# EAGLE schematic main (EAGLE 8.3.1)
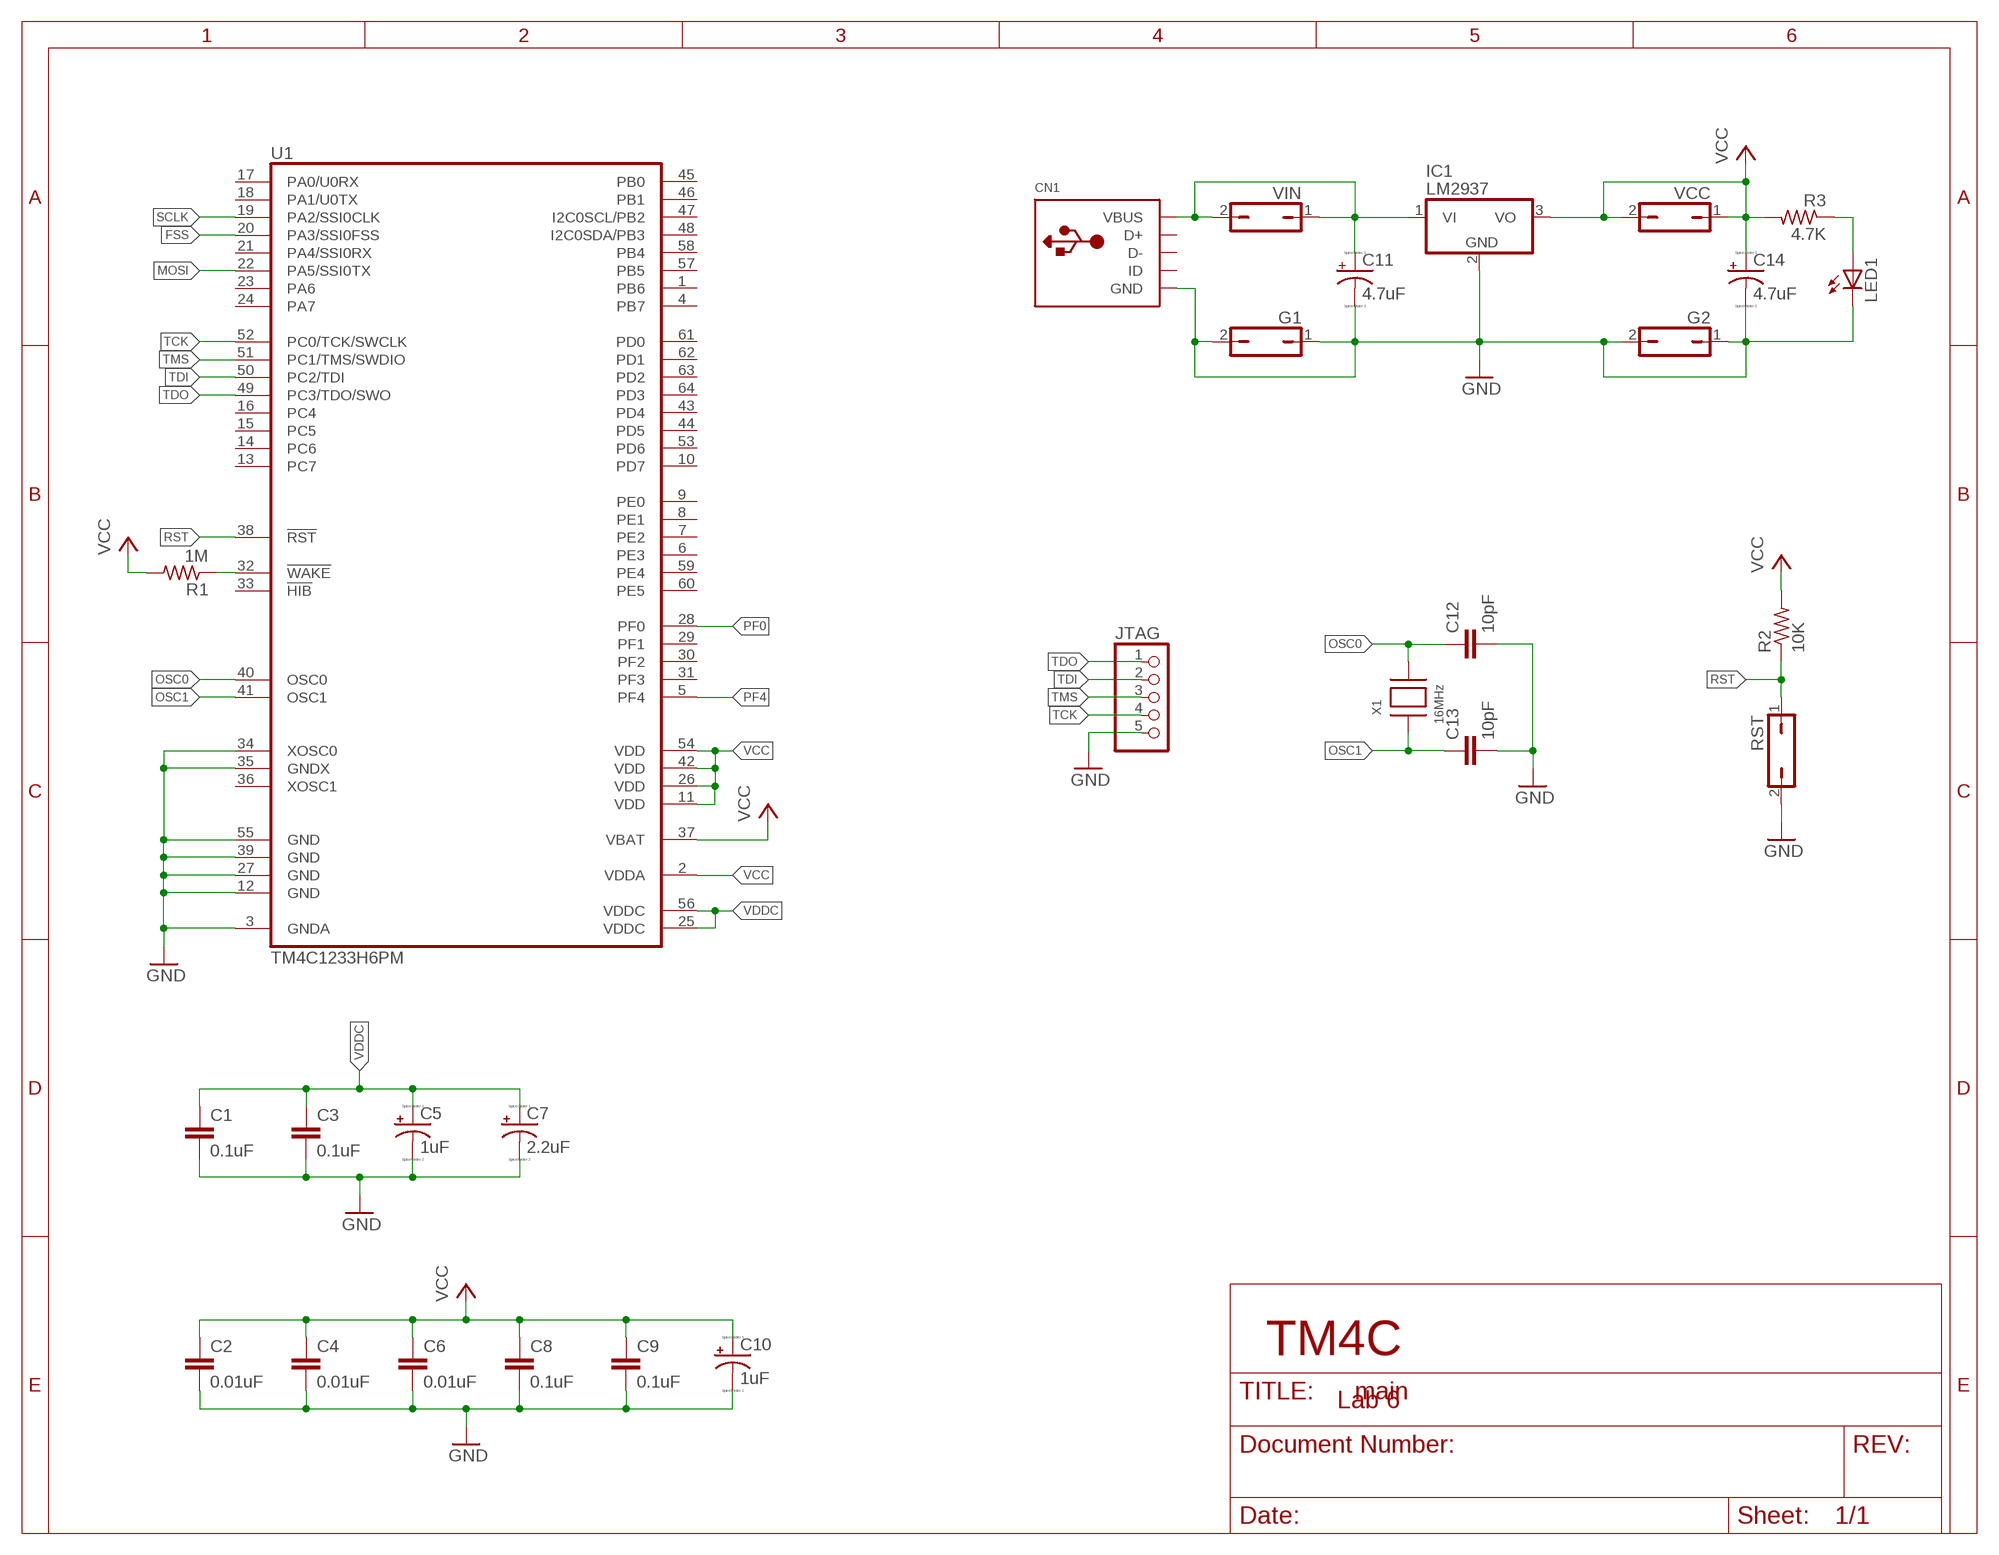
[diagram p0: schematic, sheet 1, part 1 of 2]
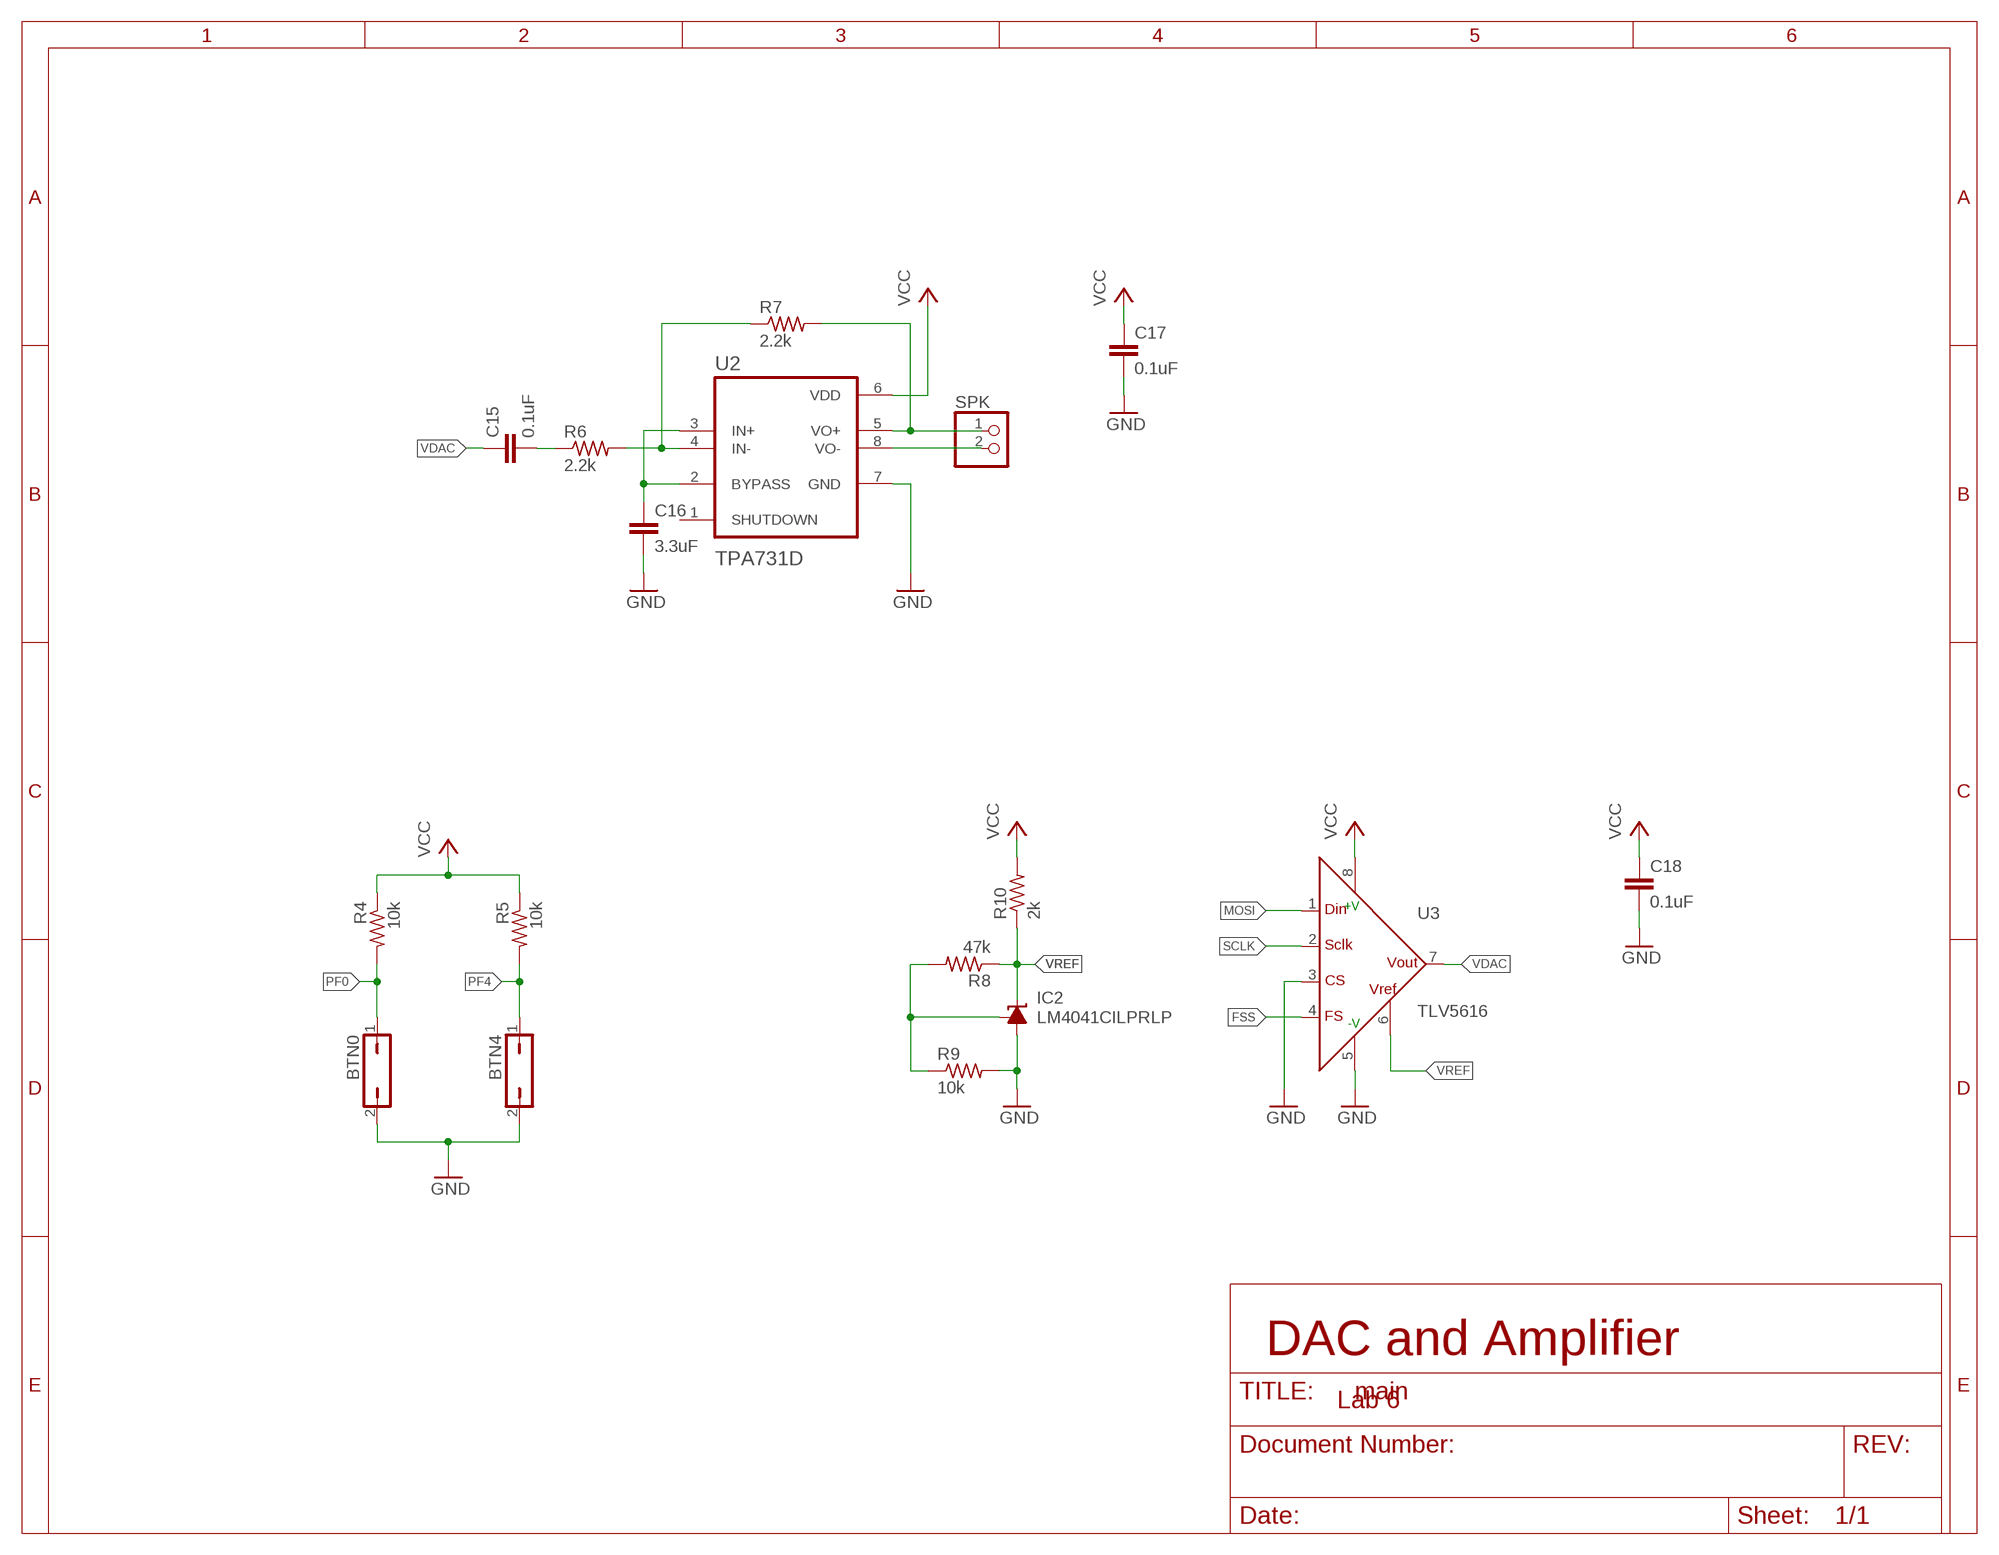
[diagram p1: schematic, sheet 1, part 2 of 2]

## Parts
BTN0  JP1Q  [JP1]
BTN4  JP1Q  [JP1]
C1  0.1uF  C-EUC0603  [C0603]
C2  0.01uF  C-EUC0603  [C0603]
C3  0.1uF  C-EUC0603  [C0603]
C4  0.01uF  C-EUC0603  [C0603]
C5  1uF  CPOL-USD  [PANASONIC_D]
C6  0.01uF  C-EUC0603  [C0603]
C7  2.2uF  CPOL-USD  [PANASONIC_D]
C8  0.1uF  C-EUC0603  [C0603]
C9  0.1uF  C-EUC0603  [C0603]
C10  1uF  CPOL-USD  [PANASONIC_D]
C11  4.7uF  CPOL-USD  [PANASONIC_D]
C12  10pF  C-EUC0603  [C0603]
C13  10pF  C-EUC0603  [C0603]
C14  4.7uF  CPOL-USD  [PANASONIC_D]
C15  0.1uF  C-EUC0603  [C0603]
C16  3.3uF  C-EU050-035X075  [C050-035X075]
C17  0.1uF  C-EUC0603  [C0603]
C18  0.1uF  C-EUC0603  [C0603]
CN1  USBMINIB  [USB-MINIB]
G1  JP1Q  [JP1]
G2  JP1Q  [JP1]
IC1  LM2937  [TO263-3]
IC2  LM4041CILPRLP  [LP_O-PBCY-W3]
JTAG  PINHD-1X5  [1X05]
LED1  LEDCHIPLED_0603  [CHIPLED_0603]
R1  1M  R-US_R0603  [R0603]
R2  10K  R-US_R0603  [R0603]
R3  4.7K  R-US_R0603  [R0603]
R4  10k  R-US_R0603  [R0603]
R5  10k  R-US_R0603  [R0603]
R6  2.2k  R-US_R0603  [R0603]
R7  2.2k  R-US_R0603  [R0603]
R8  47k  R-US_R0603  [R0603]
R9  10k  R-US_R0603  [R0603]
R10  2k  R-US_R0603  [R0603]
RST  JP1Q  [JP1]
SPK  PINHD-1X2  [1X02]
U1  TM4C1233H6PM  [LQFP64]
U2  TPA731D  [SOIC127P600X175-8N]
U3  TLV5616  [DIL08]
U$1  DIP-8  [DIP-8]  (not placed on a sheet)
VCC  JP1Q  [JP1]
VIN  JP1Q  [JP1]
X1  16MHz  XTALNX8045  [NX8045]

## Nets
5V_IN: C11.+ CN1.VBUS IC1.1(VI) VIN.1 VIN.2
AMP_DC_FILTER: C15.2 R6.1
AMP_IN+: C16.1 U2.2(BYPASS) U2.3(IN+)
AMP_IN-: R6.2 R7.1 U2.4(IN-)
FSS: U1.20(PA3/SSI0FSS) U3.4(FS)
GND: BTN0.2 BTN4.2 C1.2 C2.2 C3.2 C4.2 C5.- C6.2 C7.- C8.2 C9.2 C10.- C11.- C12.2 C13.2 C14.- C16.2 C17.2 C18.2 CN1.GND G1.1 G1.2 G2.1 G2.2 IC1.2(GND) IC2.3(A) JTAG.5 LED1.C R9.2 RST.2 U1.3(GNDA) U1.12(GND) U1.27(GND) U1.34(XOSC0) U1.35(GNDX) U1.39(GND) U1.55(GND) U2.7(GND) U3.3(CS) U3.5(AGND)
LED_RESIST: LED1.A R3.1
MOSI: U1.22(PA5/SSI0TX) U3.1(DIN)
OSC0: C12.1 U1.40(OSC0) X1.P$2
OSC1: C13.1 U1.41(OSC1) X1.P$1
PF0: BTN0.1 R4.2 U1.28(PF0)
PF4: BTN4.1 R5.2 U1.5(PF4)
RST: R2.1 RST.1 U1.38(!RST!)
SCLK: U1.19(PA2/SSI0CLK) U3.2(SCLK)
TCK: JTAG.4 U1.52(PC0/TCK/SWCLK)
TDI: JTAG.2 U1.50(PC2/TDI)
TDO: JTAG.1 U1.49(PC3/TDO/SWO)
TMS: JTAG.3 U1.51(PC1/TMS/SWDIO)
VCC: C2.1 C4.1 C6.1 C8.1 C9.1 C10.+ C14.+ C17.1 C18.1 IC1.3(VO) R1.2 R2.2 R3.2 R4.1 R5.1 R10.2 U1.2(VDDA) U1.11(VDD) U1.26(VDD) U1.37(VBAT) U1.42(VDD) U1.54(VDD) U2.6(VDD) U3.8(VDD) VCC.1 VCC.2
VDAC: C15.1 U3.7(OUT)
VDDC: C1.1 C3.1 C5.+ C7.+ U1.25(VDDC) U1.56(VDDC)
VO+: R7.2 SPK.1 U2.5(VO+)
VO-: SPK.2 U2.8(VO-)
VREF: IC2.2(C) R8.1 R10.1 U3.6(REFIN)
VREF_FEEDBACK: IC2.1(FB) R8.2 R9.1
WAKE: R1.1 U1.32(!WAKE!)
Unconnected: CN1.D+ CN1.D- CN1.ID U1.1(PB6) U1.4(PB7) U1.6(PE3) U1.7(PE2) U1.8(PE1) U1.9(PE0) U1.10(PD7) U1.13(PC7) U1.14(PC6) U1.15(PC5) U1.16(PC4) U1.17(PA0/U0RX) U1.18(PA1/U0TX) U1.21(PA4/SSI0RX) U1.23(PA6) U1.24(PA7) U1.29(PF1) U1.30(PF2) U1.31(PF3) U1.33(!HIB!) U1.36(XOSC1) U1.43(PD4) U1.44(PD5) U1.45(PB0) U1.46(PB1) U1.47(I2C0SCL/PB2) U1.48(I2C0SDA/PB3) U1.53(PD6) U1.57(PB5) U1.58(PB4) U1.59(PE4) U1.60(PE5) U1.61(PD0) U1.62(PD1) U1.63(PD2) U1.64(PD3) U2.1(SHUTDOWN) U$1.1A U$1.1B U$1.2A U$1.2B U$1.3A U$1.3B U$1.4A U$1.4B

## Notes on the sheet
- TM4C | DAC and Amplifier
- Lab 6 | Lab 6

## Library data of the parts
BTN0 BTN4 G1 G2 RST VCC VIN = jumper:JP1Q: JUMPER
C1-C4 C6 C8 C9 C12 C13 C15-C18 = rcl:C-EU: CAPACITOR, European symbol
C5 C7 C10 C11 C14 = resistor:CPOL-US: POLARIZED CAPACITOR, American symbol
CN1 = adafruit:USB: USB Connectors USBMINIB - Surface Mount Female Mini-B USB Connector 4UConnector: 06564 By microbuilder.eu Thru-hole RA Female Mini-B USB Connector 4UConnector: 18732 By ladyada.net
IC1 = linear:LM2937: LM2937-2.5, LM2937-3.3 400mA and 500mA Voltage Regulators Source: http://cache.national.com/ds/LM/LM2937-2.5.pdf
IC2 = LM4041CILPR:LM4041CILPR: PRECISION MICROPOWER SHUNT VOLTAGE REFERENCE Adjustable Output Source: http://focus.ti.com/lit/ds/slcs146e/slcs146e.pdf LM4041CILPR Let R1 be the resistor from Vref to +3.3V Let R2 be the resistor from Vref to FB Let R3 be the resistor from FB to ground Vref = 1.23*(1+R3/R2) Iref=(3.3V-Vref)/R1 - 100uA; AVAILABILITY: Unavailable; DESCRIPTION: Adjustable Precision Micropower Shunt Voltage Reference, 0.5% accuracy 3-TO-92 -40 to 85; MF: Texas Instruments; MP: LM4041CILPR; PACKAGE: TO-92 Texas Instruments; PRICE: None
JTAG = pinhead:PINHD-1X5: PIN HEADER
LED1 = adafruit:LED: LED OSRAM: - CHIPLED LG R971, LG N971, LY N971, LG Q971, LY Q971, LO R971, LY R971 LH N974, LH R974 LS Q976, LO Q976, LY Q976 LO Q996 - Hyper CHIPLED LW Q18S LB Q993, LB Q99A, LB R99A - SideLED LS A670, LO A670, LY A670, LG A670, LP A670 LB A673, LV A673, LT A673, LW A673 LH A674 LY A675 LS A676, LA A676, LO A676, LY A676, LW A676 LS A679, LY A679, LG A679 - Hyper Micro SIDELED® LS Y876, LA Y876, LO Y876, LY Y876 LT Y87S - SmartLED LW L88C, LW L88S LB L89C, LB L89S, LG L890 LS L89K, LO L89K, LY L89K LS L896, LA L896, LO L896, LY L896 - TOPLED LS T670, LO T670, LY T670, LG T670, LP T670 LSG T670, LSP T670, LSY T670, LOP T670, LYG T670 LG T671, LOG T671, LSG T671 LB T673, LV T673, LT T673, LW T673 LH T674 LS T676, LA T676, LO T676, LY T676, LB T676, LH T676, LSB T676, LW T676 LB T67C, LV T67C, LT T67C, LS T67K, LO T67K, LY T67K, LW E67C LS E67B, LA E67B, LO E67B, LY E67B, LB E67C, LV E67C, LT E67C LW T67C LS T679, LY T679, LG T679 LS T770, LO T770, LY T770, LG T770, LP T770 LB T773, LV T773, LT T773, LW T773 LH T774 LS E675, LA E675, LY E675, LS T675 LS T776, LA T776, LO T776, LY T776, LB T776 LHGB T686 LT T68C, LB T68C - Hyper Mini TOPLED® LB M676 - Mini TOPLED Santana® LG M470 LS M47K, LO M47K, LY M47K Source: http://www.osram.convergy.de/
R1-R10 = rcl:R-US_: RESISTOR, American symbol
SPK = pinhead:PINHD-1X2: PIN HEADER
U1 = ti-tiva:TM4C1233H6PM: ARM MICROCONTROLLER ARM® Cortex®-M4F Tiva™ C Microcontroller IC 32-Bit 80MHz 256KB (256K x 8) FLASH
U2 = TPA731D:TPA731D: None; AVAILABILITY: Unavailable; DESCRIPTION: 700-mW Mono, Differential Input, Class-AB Audio Amplifier with Active High Shutdown 8-SOIC -40 to 85; MF: Texas Instruments; MP: TPA731D; PACKAGE: SOIC-8 Texas Instruments; PRICE: None
U3 = TLV5616:TLV5616: TLV5616 12-bit DAC SSI digital input, one analog output Vout = (2*n*Vref)/4096; AVAILABILITY: Unavailable; DESCRIPTION: 12 Bit Digital to Analog Converter 1 8-SOIC; MF: Texas Instruments; MP: TLV5616; PACKAGE: SOIC-8 Texas Instruments; PRICE: None
U$1 = lab_6:DIP-8
X1 = adafruit:XTAL: Low cost SMT crystals, no capacitors included http://www.ladyada.net/library/eagle